# EAGLE design BPW5002-microSD_1.3 (EAGLE 6.6.0)
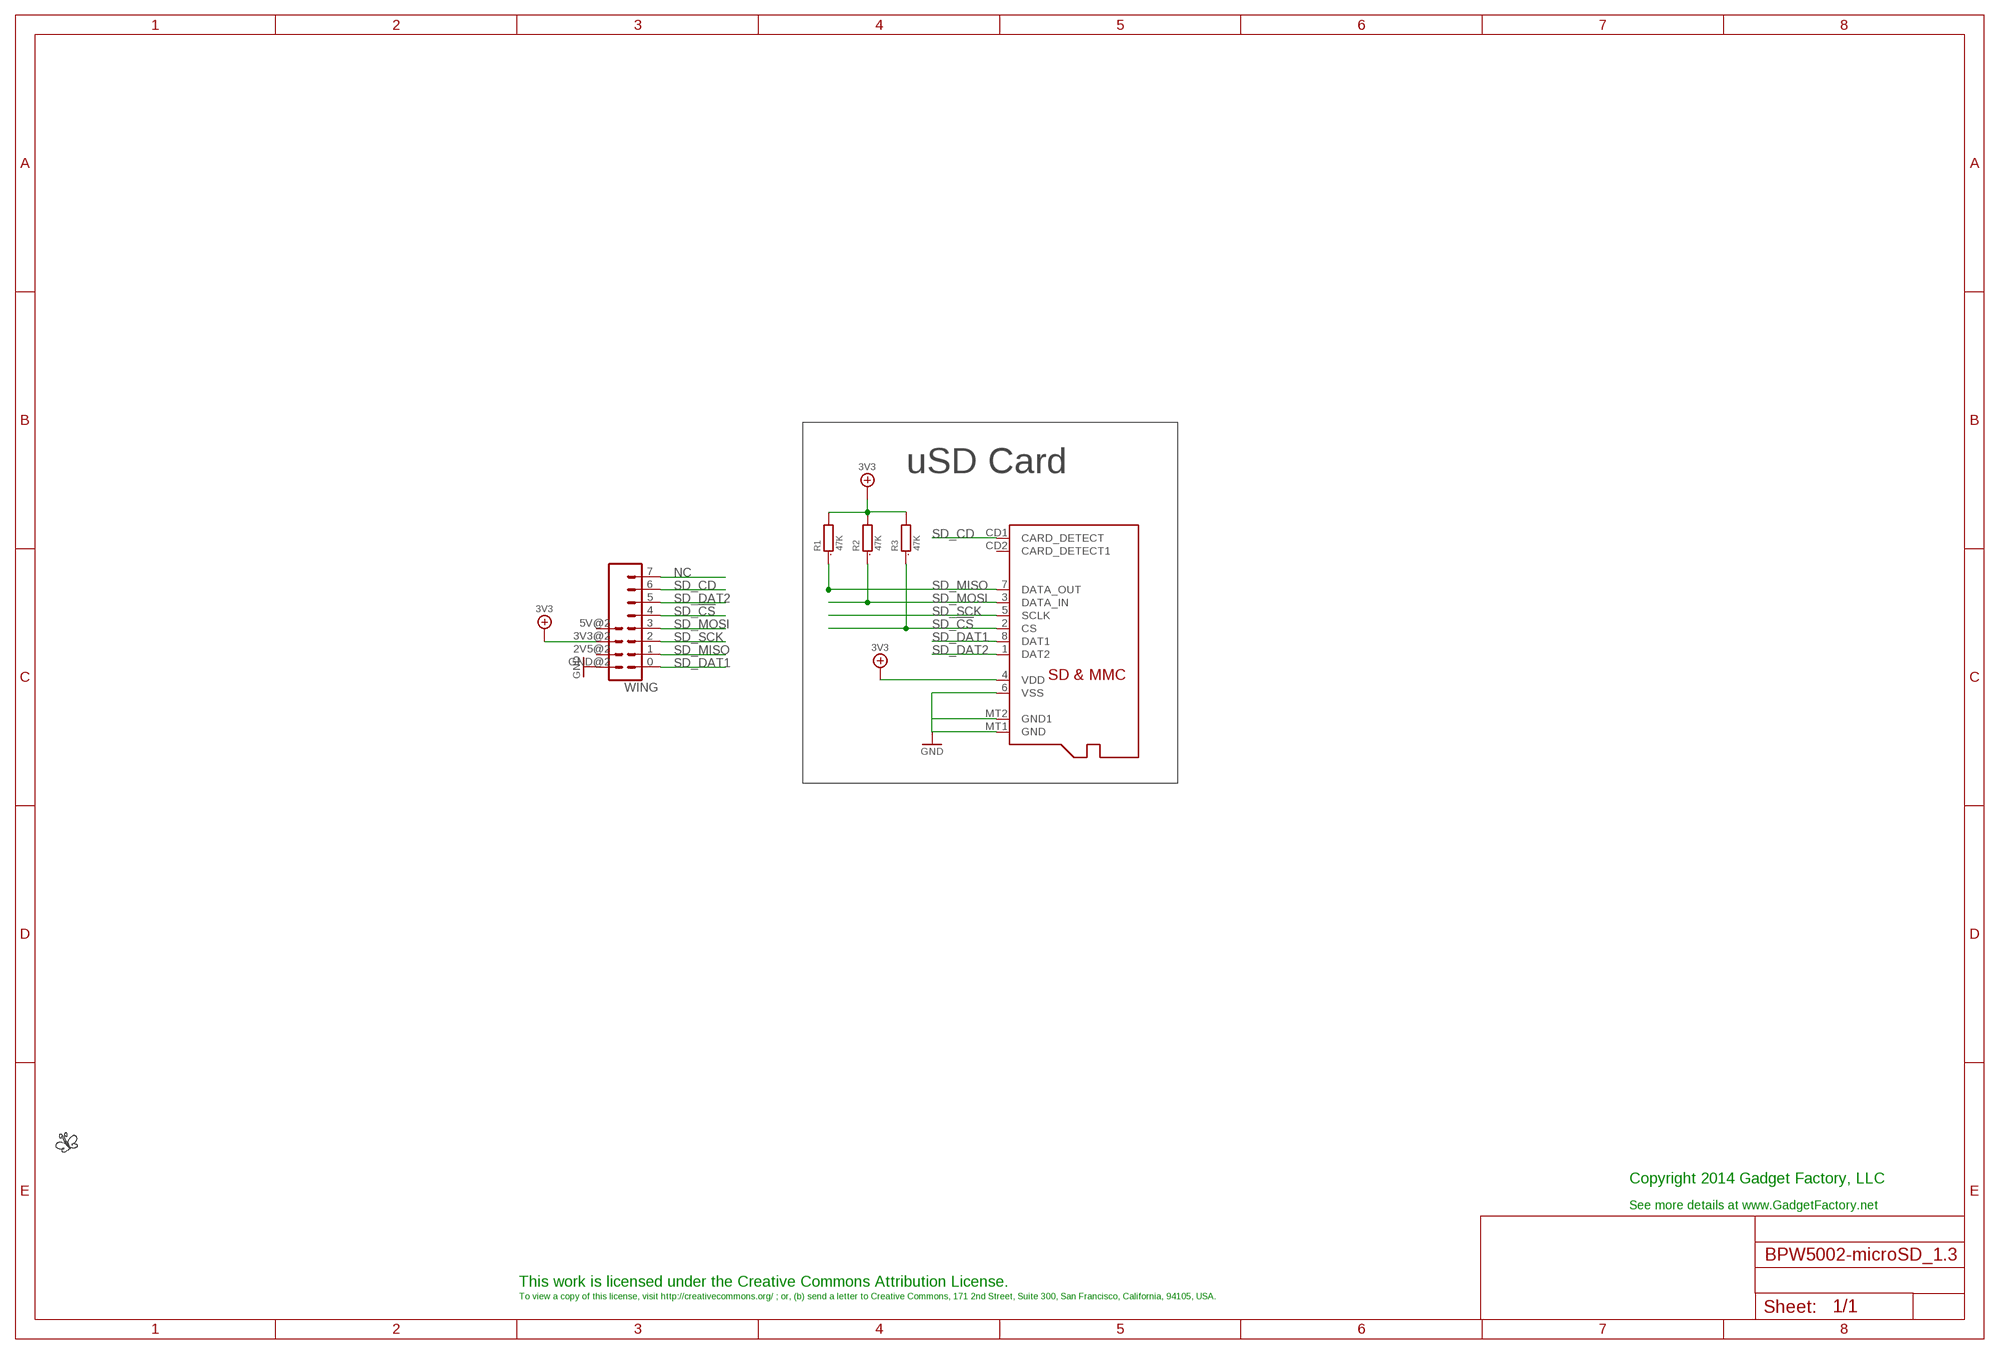
[diagram p0: schematic, sheet 1]

## Parts
LOGO2  BUTTERFLY_LOGO  [BUTTERFLY_LOGO]
R1  47K  R0805  [0805]
R2  47K  R0805  [0805]
R3  47K  R0805  [0805]
SD1  MICROSD  [MICROSD]
WING  WING8WING8_NOHOLES  [WINGSIDE_8BIT_NOHOLES]

## Nets
3V3: R1.2 R2.2 R3.2 SD1.4(VDD) WING.3V3@2(3V3)
GND: SD1.6(VSS) SD1.MT1(GND) SD1.MT2(GND1) WING.GND@2(GND)
NC: WING.7
SD_!CS: R3.1 SD1.2(CS) WING.4
SD_CD: SD1.CD1(CARD_DETECT) WING.6
SD_DAT1: SD1.8(DAT1) WING.0
SD_DAT2: SD1.1(DAT2) WING.5
SD_MISO: R1.1 SD1.7(DATA_OUT) WING.1
SD_MOSI: R2.1 SD1.3(DATA_IN) WING.3
SD_SCK: SD1.5(SCLK) WING.2
Unconnected: SD1.CD2(CARD_DETECT1) WING.2V5@2(2V5) WING.5V@2(5V)

## Notes on the sheet
- uSD Card
- Copyright 2014 Gadget Factory, LLC
- See more details at www.GadgetFactory.net
- This work is licensed under the Creative Commons Attribution License.
- To view a copy of this license, visit http://creativecommons.org/ ; or, (b) send a letter to Creative Commons, 171 2nd Street, Suite 300, San Francisco, California, 94105, USA.

## Library data of the parts
LOGO2 = GadgetFactory_Pub:BUTTERFLY_LOGO; BOM: EXCLUDE
R1-R3 = GadgetFactory_6.0:R: RESISTOR, European symbol; PARTNO: RMCF0805JT47K0
SD1 = adafruit:MICROSD: Micro-SD / Transflash card holder with SPI pinout For the 3M # 2908-05WB-MG and/or 4UCON #19656 push-push type; PARTNO: 101-00660-68-6
WING = Papilio:WING8; PARTNO: 68001-112HLF

## Board
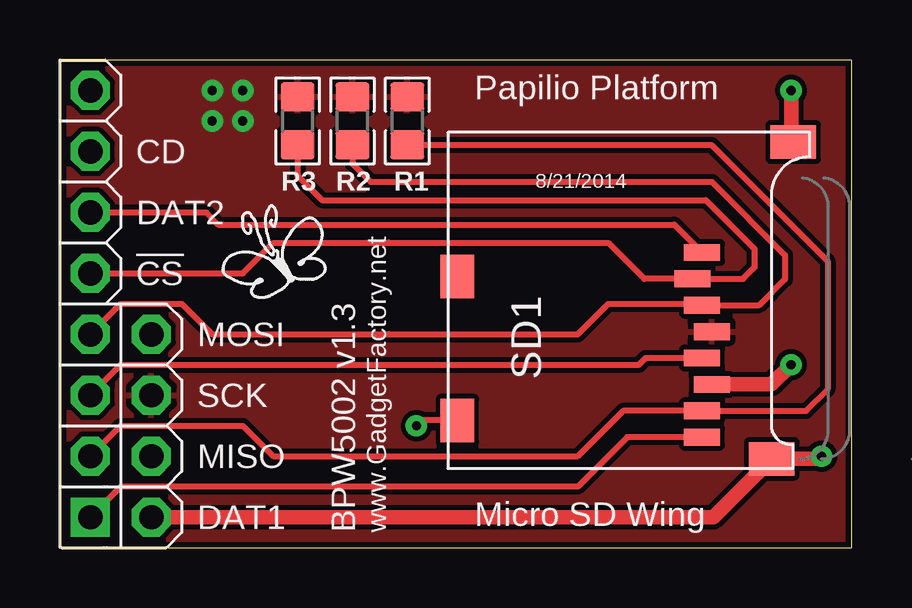
[diagram p1: board, top side]
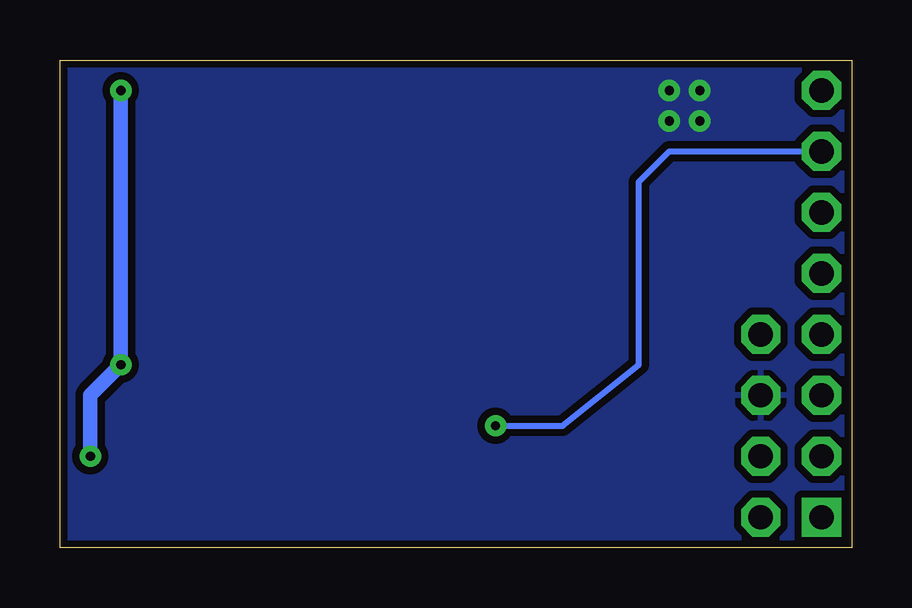
[diagram p2: board, bottom side, seen from below]

Size 33.02 x 20.32 mm. Coordinates in mm from the lower left corner, seen from the top.
Outline: 0,0 33.02,0 33.02,20.32 0,20.31 0,0
Copper layers (1*16): Top 0.035mm / dielectric 1.5mm / Bottom 0.035mm
Design rules "SparkFun_Derived_GoldePheonix_10mil": minimum track width 10mil, minimum drill 15mil, track to track 8mil, track to pad 8mil, pad to pad 8mil, via to via 8mil, smd to smd 8mil, copper to edge 10mil, drill to drill 8mil, minimum pad ring 12mil, minimum via ring 10mil, stop-mask expansion 4mil, vias tented up to drill 18mil, thermal gap 10mil

### Footprints (pad centres in the part's own frame; a part is rotated, then mirrored left to right if it is on the bottom)
0805 = smd 1.2 x 1.4: 1 -1,0; 2 1,0
MICROSD = smd 0.7 x 1.5: 1 9,-10.64; 2 7.9,-10.24; 3 6.8,-10.64; 4 5.7,-11.04; 5 4.6,-10.64; 6 3.5,-11.04; 7 2.4,-10.64; 8 1.3,-10.64 | smd 1.8 x 1.4: CD1 2,-0.44; CD2 8,-0.44 | smd 1.4 x 1.9: MT1 0.4,-13.54; MT2 13.6,-14.44
WINGSIDE_8BIT_NOHOLES = drill 1.016 square: 0 19.05,1.27 | drill 1.016 octagon: 1 16.51,1.27; 2 13.97,1.27; 2V5@2 16.51,3.81; 3 11.43,1.27; 3V3@2 13.97,3.81; 4 8.89,1.27; 5 6.35,1.27; 5V@2 11.43,3.81; 6 3.81,1.27; 7 1.27,1.27; GND@2 19.05,3.81

### Placement (x,y rotation side)
LOGO2  9.02,11.81 0 top
R1  14.48,17.78 90 top
R2  12.19,17.78 90 top
R3  9.91,17.78 90 top
SD1  16.13,3.3 90 top
WING  0,20.32 270 top

### Tracks (layer width: path | path; a pad name or v marks a point on that pad's centre or on a via)
3V3  (via drill 0.38)
  other vias: 6.35,17.78 7.62,17.78 7.62,19.05 6.35,19.05
  pour Top: 0,20.32 33.02,20.32 33.02,0 0,0
  pour Bottom (isolate 0.305): 0,20.32 33.02,20.32 33.02,0 0,0
GND  (via drill 0.38)
  Top 0.61: WING.GND@2 27.24,1.27 SD1.MT1 31.64,3.7 v31.75,3.81 | v30.48,19.05 30.48,16.99 SD1.MT2 | SD1.6 29.66,6.8 v30.48,7.62
  Bottom 0.61: v31.75,3.81 31.75,6.35 v30.48,7.62 30.48,8.89 v30.48,19.05
SD_!CS
  Top 0.254: WING.4 7.62,11.43 8.89,12.7 13.72,12.7 | 13.72,12.7 22.86,12.7 24.36,11.2 SD1.2 28.47,11.2 28.96,11.68 28.96,12.45 26.92,14.48 10.92,14.48 9.91,15.49 R3.1 | 13.7,12.72 13.72,12.7
SD_CD  (via drill 0.38)
  Top 0.254: SD1.CD1 15.08,5.3 v14.86,5.08
  Bottom 0.254: v14.86,5.08 12.06,5.08 8.89,7.62 8.89,15.24 7.62,16.51 WING.6
SD_DAT1
  Top 0.254: SD1.8 23.65,4.6 21.59,2.54 2.54,2.54 WING.0
SD_DAT2
  Top 0.254: WING.5 6.1,13.97 6.6,13.46 25.61,13.46 SD1.1
SD_MISO
  Top 0.254: WING.1 2.54,5.08 7.62,5.08 8.89,3.81 21.59,3.81 23.48,5.7 SD1.7 31.1,5.7 32,6.6 32,11.94 27.16,16.78 R1.1
SD_MOSI
  Top 0.254: WING.3 2.54,10.16 5.08,10.16 6.35,8.89 13.72,8.89 | 13.72,8.89 21.59,8.89 22.86,10.16 26.71,10.16 SD1.3 29.15,10.1 30.23,11.18 30.23,12.19 27.18,15.24 12.95,15.24 12.19,16 R2.1 | 13.7,8.91 13.72,8.89
SD_SCK
  Top 0.254: WING.2 2.54,7.62 24.13,7.62 24.41,7.9 SD1.5

### Text on the board
tPlace: Papilio Platform | CD | 8/21/2014 | DAT2 | !CS | MOSI | SCK | MISO | DAT1 | BPW5002 v1.3 | www.GadgetFactory.net | Micro SD Wing